# EAGLE schematic CMoy-Pro-Buffer-Board-V_1_0_0_1a (EAGLE 9.3.2)
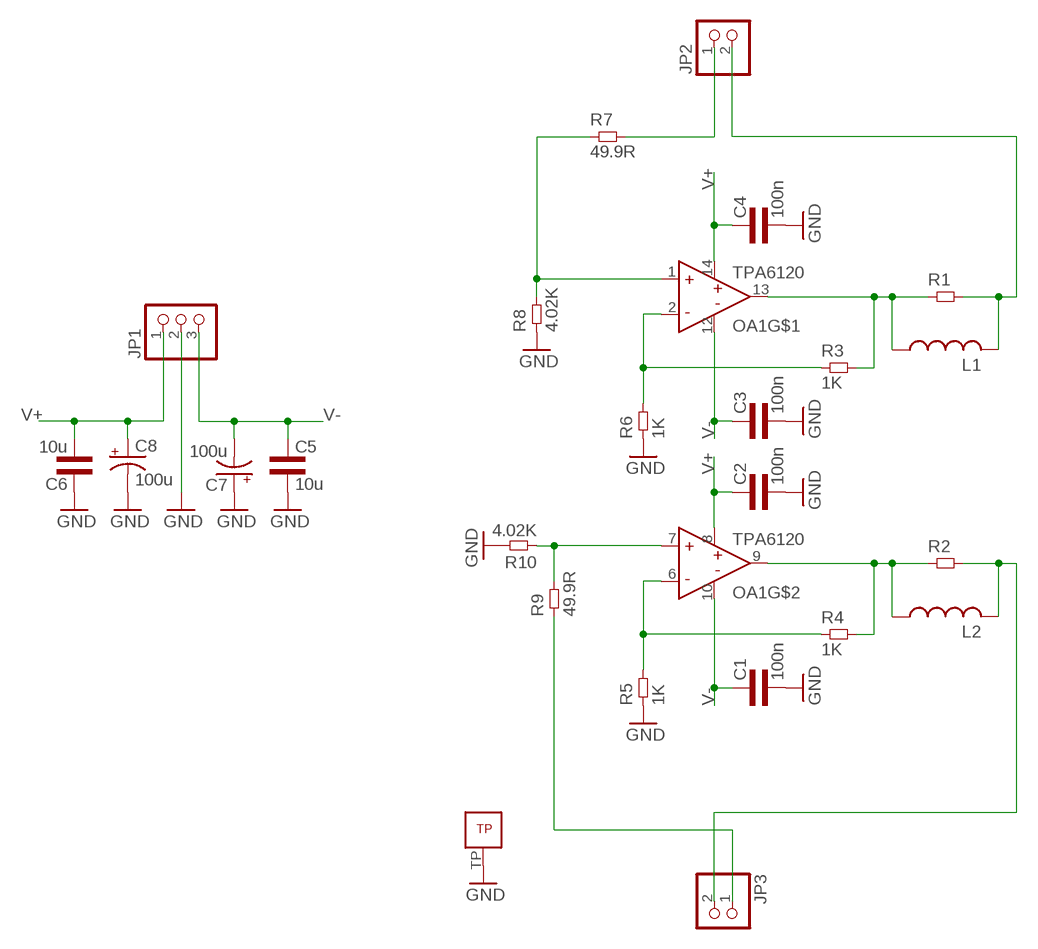
[diagram p0: schematic, sheet 1]

## Parts
C1  100n  CAP0603L3  [0603L3]
C2  100n  CAP0603L3  [0603L3]
C3  100n  CAP0603L3  [0603L3]
C4  100n  CAP0603L3  [0603L3]
C5  10u  CAP0805L3  [0805L3]
C6  10u  CAP0805L3  [0805L3]
C7  100u  CPOL-USCT7343  [CT7343]
C8  100u  CPOL-USCT7343  [CT7343]
JP1  PINHD-1X3  [1X03]
JP2  PINHD-1X2  [1X02]
JP3  PINHD-1X2  [1X02]
L1  L-USL2012C  [L2012C]
L2  L-USL2012C  [L2012C]
OA1  TPA6120QFN  [S-PVQFN-N14]
R1  RES1210L3  [1210L3]
R2  RES1210L3  [1210L3]
R3  1K  RES0603L3  [0603L3]
R4  1K  RES0603L3  [0603L3]
R5  1K  RES0603L3  [0603L3]
R6  1K  RES0603L3  [0603L3]
R7  49.9R  RES0603L3  [0603L3]
R8  4.02K  RES0603L3  [0603L3]
R9  49.9R  RES0603L3  [0603L3]
R10  4.02K  RES0603L3  [0603L3]

## Nets
GND: C1.P$2 C2.P$2 C3.P$2 C4.P$2 C5.2 C6.1 C7.+ C8.- JP1.2 OA1.TP R5.P$1 R6.P$1 R8.P$1 R10.P$2
N$1: L2.1 OA1.9(OUT) R2.P$1 R4.P$2
N$2: JP3.2 L2.2 R2.P$2
N$3: OA1.6(IN-) R4.P$1 R5.P$2
N$4: L1.1 OA1.13(OUT) R1.P$1 R3.P$2
N$5: JP2.2 L1.2 R1.P$2
N$6: OA1.2(IN-) R3.P$1 R6.P$2
N$7: OA1.1(IN+) R7.P$1 R8.P$2
N$8: JP3.1 R9.P$1
N$9: OA1.7(IN+) R9.P$2 R10.P$1
N$12: JP2.1 R7.P$2
V+: C2.P$1 C4.P$1 C6.2 C8.+ JP1.1 OA1.8(V+) OA1.14(V+)
V-: C1.P$1 C3.P$1 C5.1 C7.- JP1.3 OA1.10(V-) OA1.12(V-)

## Library data of the parts
C1-C6 = common:CAP
C7 C8 = rcl:CPOL-US: POLARIZED CAPACITOR, American symbol
JP1 = pinhead:PINHD-1X3: PIN HEADER
JP2 JP3 = pinhead:PINHD-1X2: PIN HEADER
L1 L2 = rcl:L-US: INDUCTOR, American symbol
OA1 = common:TPA6120
R1-R10 = common:RES